# EAGLE design I2C Driver + DMX (EAGLE 5.11)
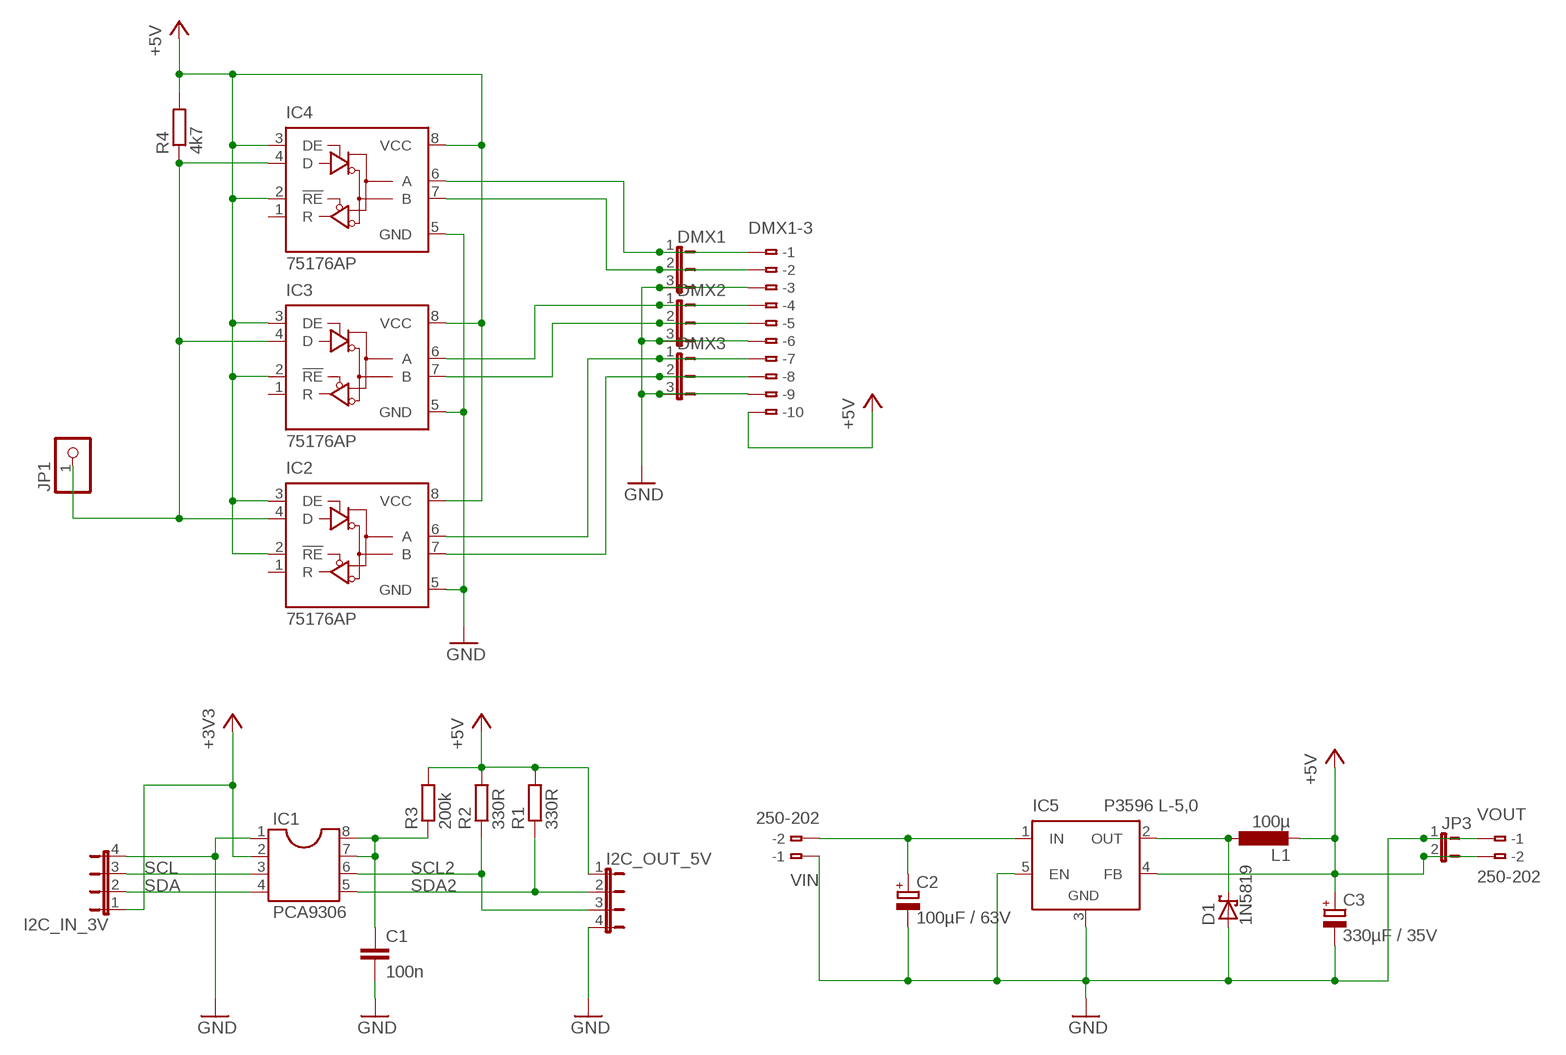
[diagram p0: schematic, sheet 1]

## Parts
C1  100n  C-EU025-025X050  [C025-025X050]
C2  100µF / 63V  CPOL-EUE5-10.5  [E5-10,5]
C3  330µF / 35V  CPOL-EUE5-10.5  [E5-10,5]
D1  1N5819  1N5817-B  [DO41-7.6]
DMX1  JP2E  [JP2]
DMX1-3  250-210  [250-210]
DMX2  JP2E  [JP2]
DMX3  JP2E  [JP2]
I2C_IN_3V  JP4E  [JP4]
I2C_OUT_5V  JP4E  [JP4]
IC1  PCA9306  DIL8  [DIL08]
IC2  75176AP  [DIL08]
IC3  75176AP  [DIL08]
IC4  75176AP  [DIL08]
IC5  P3596 L-5,0  LM2596TV  [TO220-51]
JP1  PINHD-1X1  [1X01]
JP3  JP1E  [JP1]
L1  100µ  L-EUPISR  [PISR]
R1  330R  R-EU_0207/10  [0207/10]
R2  330R  R-EU_0207/10  [0207/10]
R3  200k  R-EU_0207/10  [0207/10]
R4  4k7  R-EU_0207/10  [0207/10]
VIN  250-202  [250-202]
VOUT  250-202  [250-202]

## Nets
+3V3: I2C_IN_3V.1 IC1.2
+5V: C3.+ DMX1-3.B10(-10) I2C_OUT_5V.1 IC2.2(!RE) IC2.3(DE) IC2.8(VCC) IC3.2(!RE) IC3.3(DE) IC3.8(VCC) IC4.2(!RE) IC4.3(DE) IC4.8(VCC) IC5.4(FB) JP3.2 L1.2 R1.2 R2.2 R3.2 R4.2 VOUT.B2(-2)
DMX1: DMX1-3.A1(-1) DMX1.1 IC4.6(A)
DMX_IN: IC2.4(D) IC3.4(D) IC4.4(D) JP1.1 R4.1
GND: C1.2 C2.- C3.- D1.A DMX1-3.A3(-3) DMX1-3.A9(-9) DMX1-3.B6(-6) DMX1.3 DMX2.3 DMX3.3 I2C_IN_3V.4 I2C_OUT_5V.4 IC1.1 IC2.5(GND) IC3.5(GND) IC4.5(GND) IC5.3(GND) IC5.5(EN) JP3.1 VIN.A1(-1) VOUT.A1(-1)
N$1: C1.1 IC1.7 IC1.8 R3.1
N$2: C2.+ IC5.1(IN) VIN.B2(-2)
N$5: D1.C IC5.2(OUT) L1.1
N$6: DMX1-3.B2(-2) DMX1.2 IC4.7(B)
N$7: DMX1-3.B4(-4) DMX2.1 IC3.6(A)
N$8: DMX1-3.A5(-5) DMX2.2 IC3.7(B)
N$9: DMX1-3.A7(-7) DMX3.1 IC2.6(A)
N$10: DMX1-3.B8(-8) DMX3.2 IC2.7(B)
SCL: I2C_IN_3V.3 IC1.3
SCL2: I2C_OUT_5V.3 IC1.6 R2.1
SDA: I2C_IN_3V.2 IC1.4
SDA2: I2C_OUT_5V.2 IC1.5 R1.1
Unconnected: IC2.1(R) IC3.1(R) IC4.1(R)

## Library data of the parts
C1 = resistor:C-EU: CAPACITOR, European symbol
C2 C3 = resistor:CPOL-EU: POLARIZED CAPACITOR, European symbol
D1 = diode:1N581*: 1.0A SCHOTTKY BARRIER RECTIFIER Source: http://www.diodes.com/datasheets/ds23001.pdf
DMX1-DMX3 = jumper:JP2E: JUMPER
DMX1-3 = Benjamin:250-210: WAGO Cage Clamp; MPN: 233-110; OC_FARNELL: unknown; OC_NEWARK: 28K9052
I2C_IN_3V I2C_OUT_5V = jumper:JP4E: JUMPER
IC1 = ic-package:DIL8: Dual In Line / Socket
IC2-IC4 = 751xx:75176A: DIFFERENTIAL BUS TRANSCEIVER Source: http://focus.ti.com/lit/ds/symlink/sn75176a.pdf
IC5 = linear:LM2596T: STEP-DOWN VOLTAGE REGULATOR
JP1 = pinhead:PINHD-1X1: PIN HEADER
JP3 = jumper:JP1E: JUMPER
L1 = Inductor-Fastron:L-EU
R1-R4 = resistor:R-EU_: RESISTOR, European symbol
VIN VOUT = Benjamin:250-202

## Board
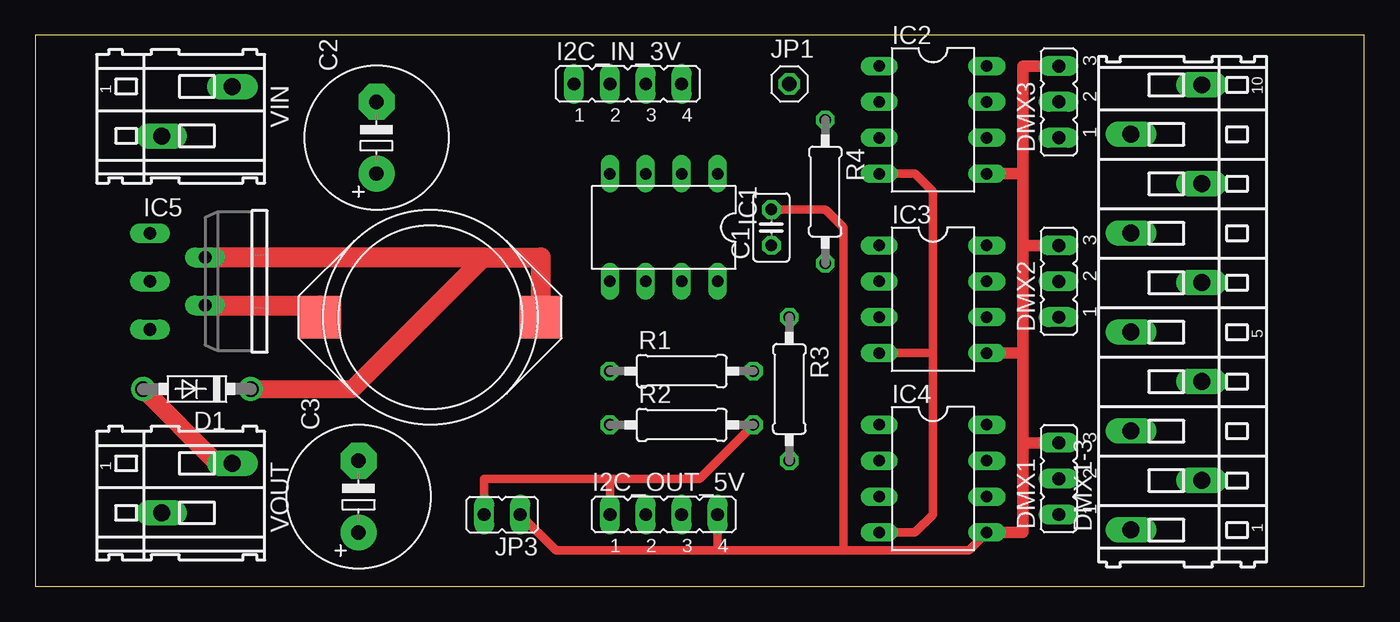
[diagram p1: board, top side]
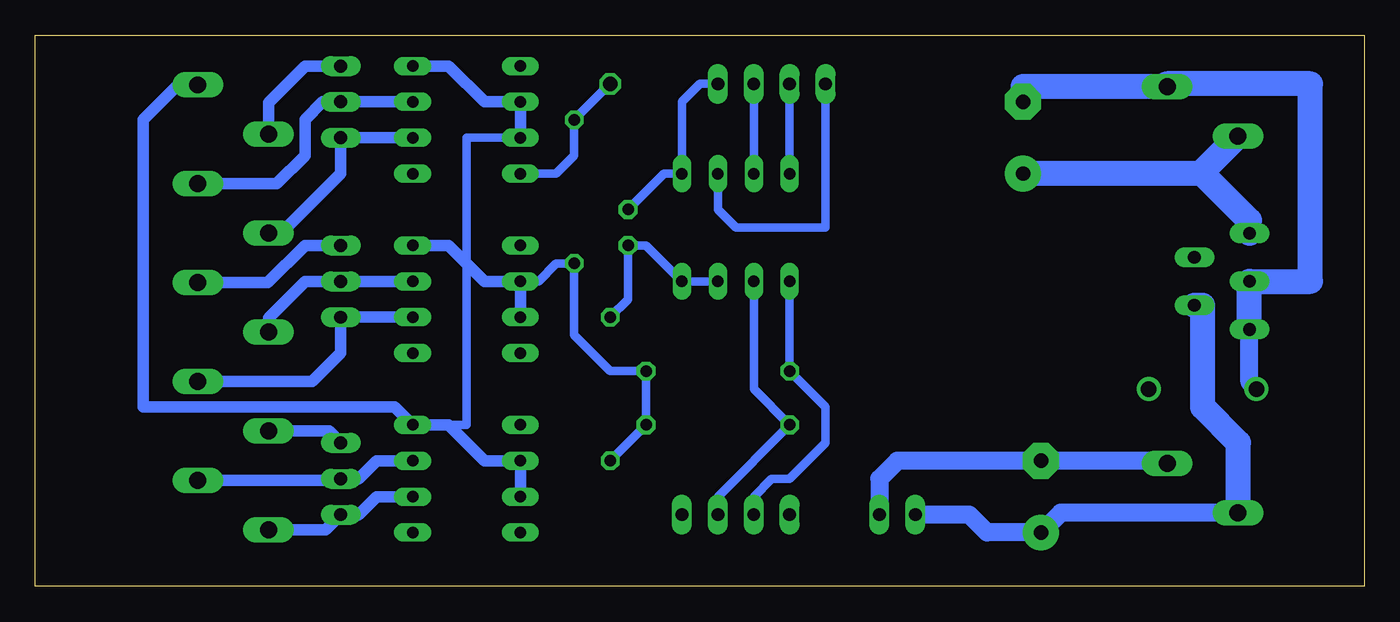
[diagram p2: board, bottom side, seen from below]

Size 94 x 39 mm. Coordinates in mm from the lower left corner, seen from the top.
Outline: 0,0 94,0 94,39 0,39 0,0
Copper layers (1*16): Top 0.035mm / dielectric 1.5mm / Bottom 0.035mm
Design rules "default": minimum track width 10mil, minimum drill 24mil, track to track 8mil, track to pad 8mil, pad to pad 8mil, via to via 8mil, smd to smd 8mil, copper to edge 40mil, drill to drill 8mil, minimum pad ring 10mil, minimum via ring 8mil, stop-mask expansion 4mil, vias tented up to drill 0mil, thermal gap 10mil

### Footprints (pad centres in the part's own frame; a part is rotated, then mirrored left to right if it is on the bottom)
C025-025X050 = drill 0.813 octagon: 1 -1.27,0; 2 1.27,0
E5-10,5 = drill 1.016 pad 2.54 round: + -2.54,0 | drill 1.016 pad 2.54 octagon: - 2.54,0
DO41-7.6 = drill 1.1 pad 1.7 round: A 3.81,0; C -3.81,0
JP2 = drill 0.914 long: 1 -2.54,0; 2 0,0; 3 2.54,0
250-210 = drill 1.2 long: A1 -11.25,2.5; A3 -4.25,2.5; A5 2.75,2.5; A7 9.75,2.5; A9 16.75,2.5; B2 -7.75,-2.5; B4 -0.75,-2.5; B6 6.25,-2.5; B8 13.25,-2.5; B10 20.25,-2.5
JP4 = drill 0.914 long: 1 -3.81,0; 2 -1.27,0; 3 1.27,0; 4 3.81,0
DIL08 = drill 0.813 long: 1 -3.81,-3.81; 2 -1.27,-3.81; 3 1.27,-3.81; 4 3.81,-3.81; 5 3.81,3.81; 6 1.27,3.81; 7 -1.27,3.81; 8 -3.81,3.81
TO220-51 = drill 0.9 long: 1 -3.4,-8.4; 2 -1.7,-4.5; 3 0,-8.4; 4 1.7,-4.5; 5 3.4,-8.4
1X01 = drill 1.016 octagon: 1 0,0
JP1 = drill 0.914 long: 1 0,-1.27; 2 0,1.27
PISR = smd 3 x 3: 1 -7.8,0; 2 7.8,0
0207/10 = drill 0.813 octagon: 1 -5.08,0; 2 5.08,0
250-202 = drill 1.2 long: A1 -11.25,2.5; B2 -7.75,-2.5

### Placement (x,y rotation side)
C1  52.07,25.4 90 top
C2  24.13,31.75 90 top
C3  22.86,6.35 90 top
D1  11.43,13.97 180 top
DMX1  72.39,7.62 90 top
DMX1-3  80.01,15.24 90 top
DMX2  72.39,21.59 90 top
DMX3  72.39,34.29 90 top
I2C_IN_3V  41.91,35.56 0 top
I2C_OUT_5V  44.45,5.08 0 top
IC1  44.45,25.4 180 top
IC2  63.5,33.02 270 top
IC3  63.5,20.32 270 top
IC4  63.5,7.62 270 top
IC5  16.51,21.59 270 top
JP1  53.34,35.56 0 top
JP3  33.02,5.08 90 top
L1  27.94,19.05 180 top
R1  45.72,15.24 0 top
R2  45.72,11.43 0 top
R3  53.34,13.97 270 top
R4  55.88,27.94 270 top
VIN  11.43,24.13 270 top
VOUT  11.43,-2.54 270 top

### Tracks (layer width: path | path; a pad name or v marks a point on that pad's centre or on a via)
+3V3
  Bottom 0.61: I2C_IN_3V.1 38.1,25.4 44.45,25.4 45.72,26.67 IC1.2
+5V
  Top 0.61: R2.2 46.99,7.62 40.64,7.62 | JP3.2 31.75,7.62 40.64,7.62 | 40.64,7.62 I2C_OUT_5V.1
  Top 1.422: IC5.4 20.14,19.89 L1.2
  Bottom 0.61: R3.2 R2.2 R1.2 53.34,15.24 55.88,17.78 R4.2 57.15,22.86 58.42,21.59 IC3.2 | IC2.3 63.5,31.75 63.5,22.86 63.5,11.43 64.77,11.43
  Bottom 0.813: IC3.8 64.77,24.13 63.5,22.86 62.23,21.59 IC3.2 IC3.3 | IC2.8 64.77,36.83 62.23,34.29 IC2.2 IC2.3 | IC4.3 IC4.2 62.23,8.89 64.77,11.43 IC4.8 68.58,12.7 86.36,12.7 86.36,33.02 83.89,35.49 DMX1-3.B10
  Bottom 1.27: VOUT.B2 21.46,5.21 C3.+ 26.67,3.81 27.94,5.08 JP3.2
  Bottom 1.778: IC5.4 11.43,19.89 11.43,12.7 8.89,10.16 8.89,5.25 VOUT.B2
DMX1
  Bottom 0.813: IC4.6 69.85,6.35 71.12,5.08 DMX1.1 73.48,3.99 DMX1-3.A1
DMX_IN
  Top 0.61: IC2.4 62.23,29.21 63.5,27.94 63.5,16.51 | 63.5,16.51 IC3.4 | 63.5,16.51 63.5,5.08 62.23,3.81 IC4.4
  Bottom 0.61: IC2.4 57.15,29.21 55.88,30.48 R4.1 JP1.1
GND
  Top 0.61: 69.85,27.94 69.85,26.67 | JP3.1 36.83,2.54 48.26,2.54 | 48.26,2.54 I2C_OUT_5V.4 | 48.26,2.54 57.15,2.54 | 57.15,2.54 66.04,2.54 IC4.5 | C1.2 55.88,26.67 57.15,25.4 57.15,2.54
  Top 0.813: IC4.5 69.85,3.81 69.85,10.16 | 69.85,10.16 DMX1.3 | 69.85,16.51 IC3.5 | 69.85,16.51 69.85,24.13 | 69.85,24.13 DMX2.3 | 69.85,29.21 IC2.5 | 69.85,29.21 69.85,36.83 DMX3.3 | 69.85,24.13 69.85,27.94 69.85,29.21 | 69.85,10.16 69.85,16.51
  Top 1.27: VOUT.A1 12.88,8.71 D1.A
  Bottom 0.61: I2C_IN_3V.4 46.99,35.56 48.26,34.29 IC1.1 49.53,29.21 C1.2
  Bottom 0.813: DMX1-3.B6 77.57,21.49 74.93,24.13 DMX2.3 | DMX1-3.A9 77.51,34.25 74.93,36.83 DMX3.3 | DMX1-3.A3 73.22,10.99 DMX1.3
  Bottom 1.27: IC5.5 8.11,14.46 D1.A | VOUT.A1 14.11,8.89 C3.- 33.02,8.89 34.29,7.62 JP3.1
  Bottom 1.778: C2.- 24.13,35.38 VIN.A1 13.97,35.38 13.97,35.56 3.81,35.56 3.81,21.59 IC5.3 IC5.5
N$1
  Bottom 0.61: IC1.7 IC1.8 50.8,24.13 C1.1 52.07,20.32 R3.1
N$2
  Bottom 1.778: C2.+ 11.6,29.21 11.52,29.3 | 11.52,29.3 VIN.B2 | IC5.1 8.11,25.89 11.52,29.3
N$5
  Top 1.27: D1.C 22.43,13.97 31.75,23.29
  Top 1.422: IC5.2 31.75,23.29 35.74,23.29 L1.1
N$6
  Bottom 0.813: IC4.7 69.85,8.89 71.12,7.62 DMX1.2 72.52,7.49 DMX1-3.B2
N$7
  Bottom 0.813: DMX1-3.B4 74.41,14.49 72.39,16.51 DMX2.1 IC3.6
N$8
  Bottom 0.813: DMX1-3.A5 77.51,19.01 74.93,21.59 DMX2.2 IC3.7
N$9
  Bottom 0.813: DMX1-3.A7 76.61,24.99 72.39,29.21 DMX3.1 IC2.6
N$10
  Bottom 0.813: DMX1-3.B8 76.92,28.49 74.93,30.48 74.93,33.02 73.66,34.29 DMX3.2 IC2.7
SCL
  Bottom 0.61: IC1.3 I2C_IN_3V.3
SCL2
  Bottom 0.61: IC1.6 43.18,13.97 R2.1 45.72,6.35 I2C_OUT_5V.3
SDA
  Bottom 0.61: IC1.4 I2C_IN_3V.2
SDA2
  Bottom 0.61: IC1.5 R1.1 38.1,12.7 38.1,10.16 40.64,7.62 41.91,7.62 43.18,6.35 I2C_OUT_5V.2